# EAGLE schematic Capteur ToF (EAGLE 6.3)
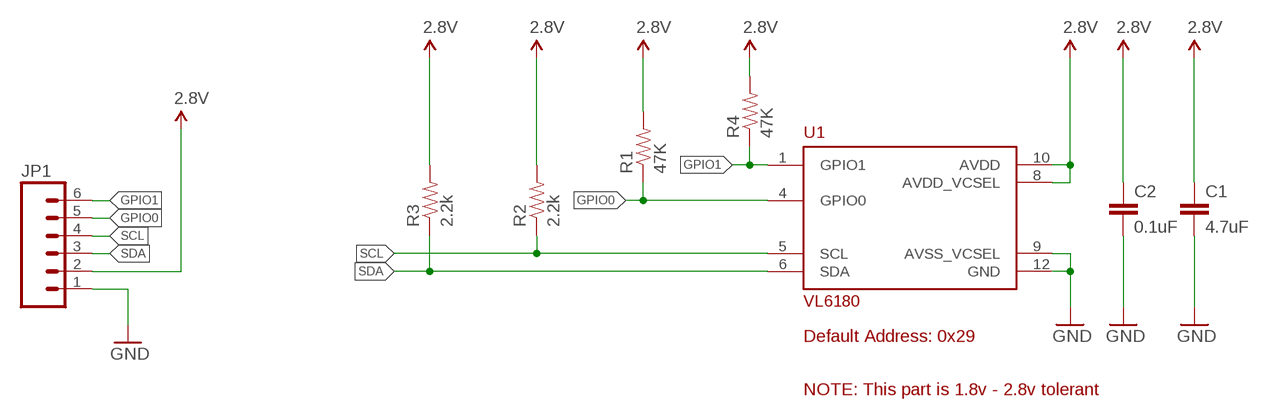
[diagram p0: schematic, sheet 1]

## Parts
C1  4.7uF  4.7UF-6.3V-10%(0603)0603  [0603-CAP]
C2  0.1uF  0.1UF-25V(+80/-20%)(0603)  [0603-CAP]
JP1  M06SIP  [1X06]
R1  47K  47KOHM1/10W1%(0603)  [0603-RES]
R2  2.2k  2.2KOHM1/10W1%(0603)  [0603-RES]
R3  2.2k  2.2KOHM1/10W1%(0603)  [0603-RES]
R4  47K  47KOHM1/10W1%(0603)  [0603-RES]
U1  VL6180  [VL6180]

## Nets
2.8V: C1.1 C2.1 JP1.2 R1.2 R2.2 R3.2 R4.2 U1.8(AVDD_VCSEL) U1.10(AVDD)
GND: C1.2 C2.2 JP1.1 U1.9(AVSS_VCSEL) U1.12(GND)
GPIO0: JP1.5 R1.1 U1.4(GPIO0)
GPIO1: JP1.6 R4.1 U1.1(GPIO1)
SCL: JP1.4 R2.1 U1.5(SCL)
SDA: JP1.3 R3.1 U1.6(SDA)

## Notes on the sheet
- Default Address: 0x29
- NOTE: This part is 1.8v - 2.8v tolerant

## Library data of the parts
C1 = SparkFun-Capacitors:4.7UF-6.3V-10%(0603): CAP-08280; PROD_ID: CAP-08280
C2 = SparkFun-Capacitors:0.1UF-25V(+80/-20%)(0603): CAP-00810 Ceramic Standard decoupling cap; PROD_ID: CAP-00810
JP1 = SparkFun-Connectors:M06: Header 6 Standard 6-pin 0.1" header. Use with straight break away headers (SKU : PRT-00116), right angle break away headers (PRT-00553), swiss pins (PRT-00743), machine pins (PRT-00117), and female headers (PRT-00115). Molex polarized connector foot print use with SKU : PRT-08094 with associated crimp pins and housings. NOTES ON THE VARIANTS LOCK and LOCK_LONGPADS... This footprint was designed to help hold the alignment of a through-hole component (i.e. 6-pin header) while soldering it into place. You may notice that each hole has been shifted either up or down by 0.005 of an inch from it's more standard position (which is a perfectly straight line). This slight alteration caused the pins (the squares in the middle) to touch the edges of the holes. Because they are alternating, it causes a "brace" to hold the component in place. 0.005 has proven to be the perfect amount of "off-center" position when using our standard breakaway headers. Although looks a little odd when you look at the bare footprint, once you have a header in there, the alteration is very hard to notice. Also,if you push a header all the way into place, it is covered up entirely on the bottom side. This idea of altering the position of holes to aid alignment will be further integrated into the Sparkfun Library for other footprints. It can help hold any component with 3 or more connection pins.
R1 R4 = SparkFun-Resistors:47KOHM1/10W1%(0603): RES-07871; PROD_ID: RES-07871
R2 R3 = SparkFun-Resistors:2.2KOHM1/10W1%(0603): RES-08272; PROD_ID: RES-08272
U1 = VL6180:VL6180; PROD_ID: IC-12007